# Altium project PCB_Project.PrjPcb
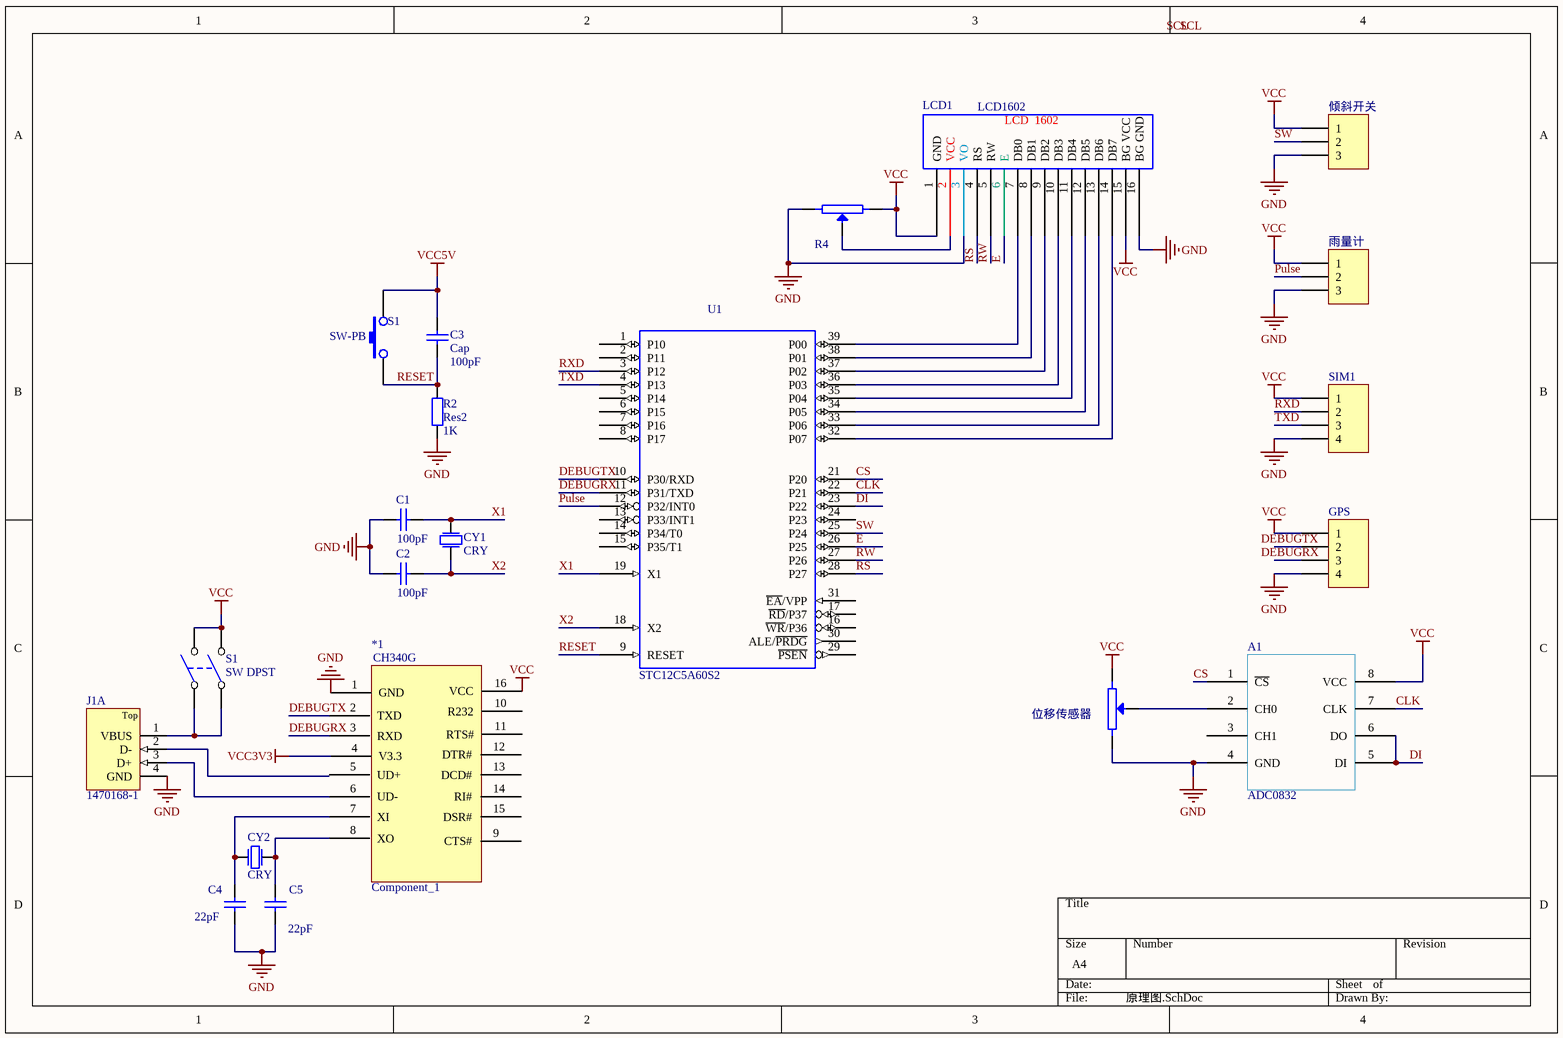
[diagram p0: 原理图.SchDoc]
1 sheet, 21 parts. Net scope: global (net labels, ports and power ports of the same name join across sheets).

## Sheet 原理图.SchDoc
size A4

### Parts
(Parts that share a designator on the sheet are numbered #1, #2 ... from top to bottom, then left to right.)
*1  Component_1
A1  ADC0832
C1  value 100pF  [RAD-0.3]  (hidden comment: Cap)
C2  value 100pF  [RAD-0.3]  (hidden comment: Cap)
C3  Cap  value 100pF  [RAD-0.3]
C4  value 22pF  [RAD-0.3]  (hidden comment: Cap)
C5  value 22pF  [RAD-0.3]  (hidden comment: Cap)
CY1  CRY  [XTAL-1]
CY2  CRY  [XTAL-1]
GPS  Header 5  [HDR1X4]  (value not drawn)
J1  1470168-1  [1470168]  (part A of 3)
LCD1  LCD1602  [1602LCD]
R2  Res2  value 1K  [AXIAL-0.4]
R4#1  (no value)  [VR5]
R4#2  位移传感器  [VR5]
S1#1  SW-PB
S1#2  SW DPST
SIM1  Header 4  [HDR1X4]  (value not drawn)
U1  STC12C5A60S2  [DIP-40]
倾斜开关  Header 3  [HDR1X3]  (value not drawn)
雨量计  Header 3  [HDR1X3]  (value not drawn)

### Nets
GND: *1.1(GND) A1.4(GND) C1.1 C2.1 C4.2 C5.1 GPS.4 J1.4(GND) LCD1.3(VO) LCD1.16(BG_GND) R2.1 R4#1.3 R4#2.3 SIM1.4 U1.20(GND) 倾斜开关.3 雨量计.3
VCC: *1.16(VCC) A1.8(VCC) GPS.1 LCD1.1(GND) LCD1.15(BG_VCC) R4#1.1 R4#2.1 S1#2.2(NO1) S1#2.4(NO2) SIM1.1 U1.40(VCC) 倾斜开关.1 雨量计.1
VCC3V3: *1.4(V3.3)
VCC5V: C3.2 S1#1.2
CLK: A1.7(CLK) U1.22(P21)
CS: A1.1(~{CS}) U1.21(P20)
DEBUGRX: *1.3(RXD) U1.11(P31/TXD)
DEBUGTX: *1.2(TXD) U1.10(P30/RXD)
DI: A1.5(DI) A1.6(DO) U1.23(P22)
E: LCD1.6(E) U1.26(P25)
Pulse: U1.12(P32/INT0) 雨量计.2
RESET: C3.1 R2.2 S1#1.1 U1.9(RESET)
RS: LCD1.4(RS) U1.28(P27)
RW: LCD1.5(RW) U1.27(P26)
RXD: SIM1.2 U1.3(P12)
SW: U1.25(P24) 倾斜开关.2
TXD: SIM1.3 U1.4(P13)
X1: C1.2 CY1.1(P1) U1.19(X1)
X2: C2.2 CY1.2(P2) U1.18(X2)
Net*1_6: *1.6(UD-) J1.3(D+)
Net*1_7: *1.7(XI) C4.1 CY2.1(P1)
Net*1_8: *1.8(XO) C5.2 CY2.2(P2)
NetA1_2: A1.2(CH0) R4#2.2(VT)
NetJ1_1: J1.1(VBUS) S1#2.1(COMMON1) S1#2.3(COMMON2)
NetLCD1_2: LCD1.2(VCC) R4#1.2(VT)
NetLCD1_7: LCD1.7(DB0) U1.39(P00)
NetLCD1_8: LCD1.8(DB1) U1.38(P01)
NetLCD1_9: LCD1.9(DB2) U1.37(P02)
NetLCD1_10: LCD1.10(DB3) U1.36(P03)
NetLCD1_11: LCD1.11(DB4) U1.35(P04)
NetLCD1_12: LCD1.12(DB5) U1.34(P05)
NetLCD1_13: LCD1.13(DB6) U1.33(P06)
NetLCD1_14: LCD1.14(DB7) U1.32(P07)

Not connected (* = marked no-connect by the designer): *1 5(UD+) 9(CTS#) 10(R232) 11(RTS#) 12(DTR#) 13(DCD#) 14(RI#) 15(DSR#); A1 3(CH1); GPS 2 3; J1 2(D-); U1 1(P10) 2(P11) 5(P14) 6(P15) 7(P16) 8(P17) 13(P33/INT1) 14(P34/T0) 15(P35/T1) 16(~{WR}/P36) 17(~{RD}/P37) 24(P23) 29(~{PSEN}) 30(ALE/~{PRDG}) 31(~{EA}/VPP)

### Notes on the sheet
- Labels drawn without touching a wire or pin: DEBUGRX, DEBUGTX, SCL
- (in symbol 1470168-1, part A) Top
- (in symbol Component_1) CH340G
- (in symbol LCD1602) LCD  1602

### Library data of the parts
C1-C5 = Cap: Capacitor; Published: 8-Jun-2000; LatestRevisionDate: 17-Jul-2002; LatestRevisionNote: Re-released for DXP Platform.; PackageReference: RAD-0.3; Publisher: Altium Limited; PackageDescription: Radial Cap, Thru-Hole; 2 Leads; 0.3 in Pin Spacing
GPS SIM1 = Header 4: Header, 4-Pin; LatestRevisionDate: 17-Jul-2002; LatestRevisionNote: Re-released for DXP Platform.; Publisher: Altium Limited
J1 = 1470168-1: USB 1.1, Right Angle, Thru-Hole, A Type, Receptacle, 4x4 Position, Stacked, Black; ContactMaterial: Copper Alloy; ContactPlating: Gold Flash; TerminationLength: 3.18mm [0.125in.]; PCB_Layout: Complies with manufacturer's recommendation.; DrillSize: Corresponds to nominal value.; PanelGround: Without; Published: 15-Jul-2004; DatasheetDocument: 15-Aug-2002; PackageDocument: 15-Aug-2002; PackageReference: 1470168; Publisher: Altium Limited; HousingMaterial: Glass-Filled Thermoplastic; ComponentLink1Description: Manufacturer Link; ComponentLink1URL: http://www.tycoelectronics.com/; ComponentLink2Description: Packaging Specification; ComponentLink2URL: http://ecommas.tycoelectronics.com/commerce/DocumentDelivery/DDEController?Action=showdoc&DocId=Customer+Drawing%7F1470168%7FA%7Fpdf%7FEnglish%7FC_1470168_A.pdf
R2 = Res2: Resistor; Published: 8-Jun-2000; LatestRevisionDate: 17-Jul-2002; LatestRevisionNote: Re-released for DXP Platform.; PackageReference: AXIAL-0.4; Publisher: Altium Limited; PackageDescription: Axial Device, Thru-Hole; 2 Leads; 0.4 in Pin Spacing
R4#1 R4#2 = RPOT2: Potentiometer
U1 = AT89C51
倾斜开关 雨量计 = Header 3: Header, 3-Pin; LatestRevisionDate: 17-Jul-2002; LatestRevisionNote: Re-released for DXP Platform.; Publisher: Altium Limited